# Altium schematic sheet ControlBoard.SchDoc
size A4; SheetNumber: 1; SheetTotal: 1
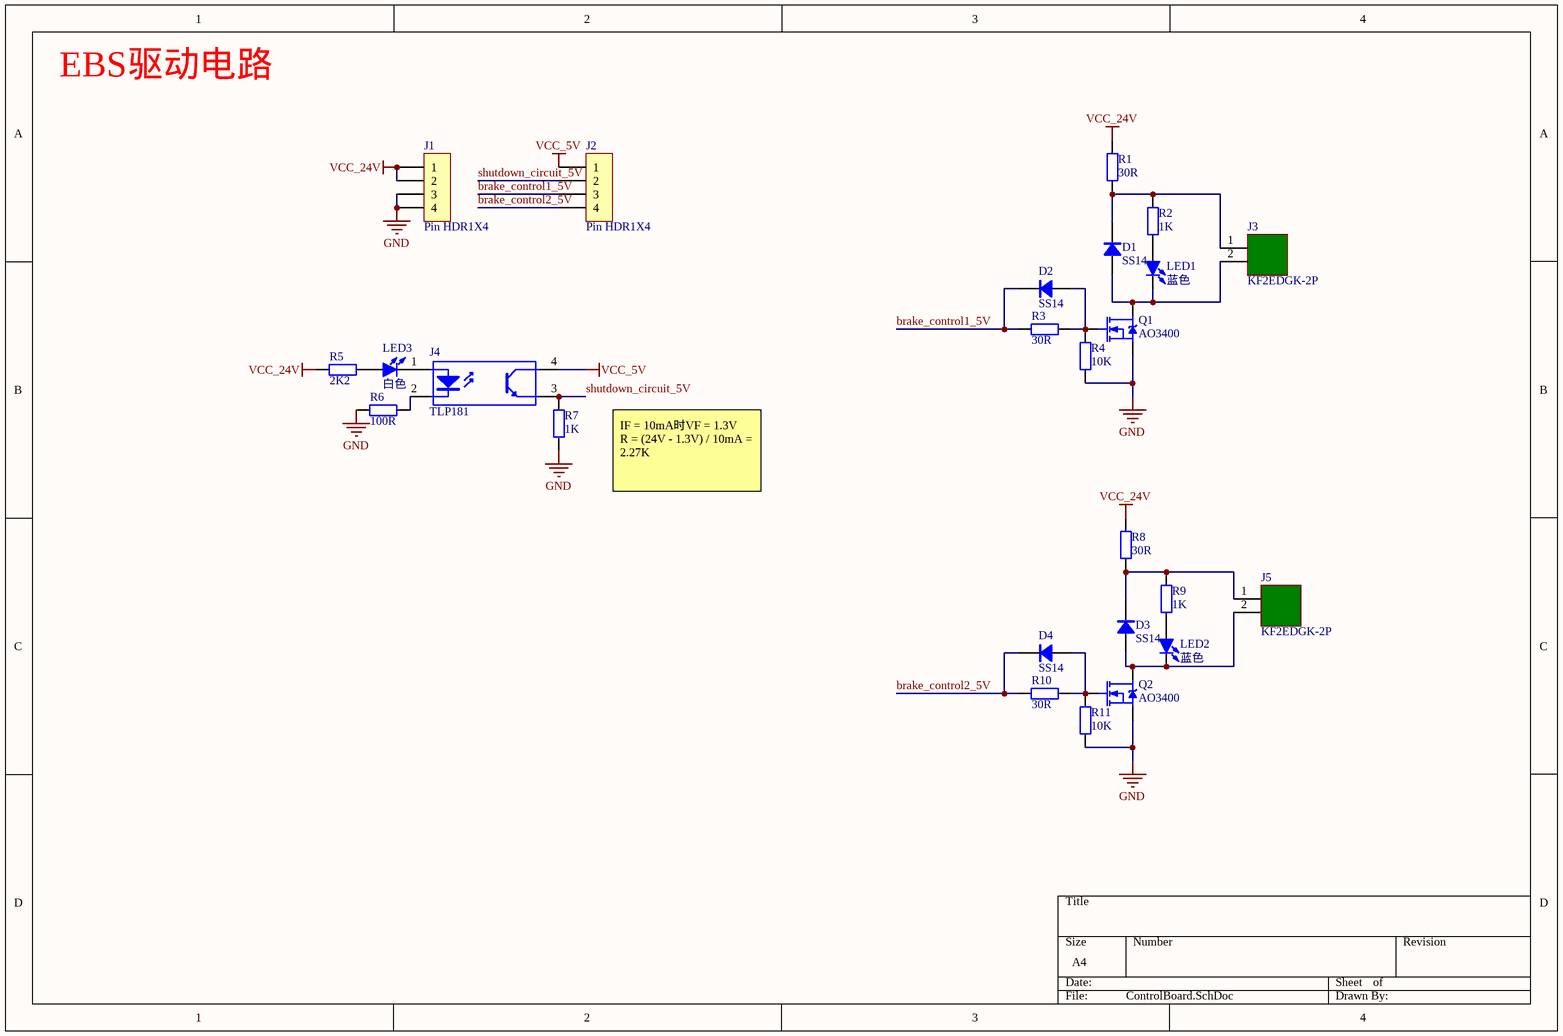
[diagram p0: ControlBoard.SchDoc]

## Parts
D1  SS14  [SMA]
D2  SS14  [SMA]
D3  SS14  [SMA]
D4  SS14  [SMA]
J1  Pin HDR1X4  [Pin HDR1X4/2.54mm-S]
J2  Pin HDR1X4  [Pin HDR1X4/2.54mm-S]
J3  KF2EDGK-2P  [KF2EDGK5.08W-2P]
J4  TLP181  [SOP4]
J5  KF2EDGK-2P  [KF2EDGK5.08W-2P]
LED1  蓝色  [LED 0805B]
LED2  蓝色  [LED 0805B]
LED3  白色  [LED 0805W]
Q1  AO3400  [SOT23]
Q2  AO3400  [SOT23]
R1  30R  [0805R]
R2  1K  [0805R]
R3  30R  [0805R]
R4  10K  [0805R]
R5  2K2  [0805R]
R6  100R  [0805R]
R7  1K  [0805R]
R8  30R  [0805R]
R9  1K  [0805R]
R10  30R  [0805R]
R11  10K  [0805R]

## Nets
GND: J1.3 J1.4 Q1.S Q2.S R4.2 R6.2 R7.2 R11.2
VCC_5V: J2.1 J4.4(C)
VCC_24V: J1.1 J1.2 R1.1 R5.2 R8.1
brake_control1_5V: D2.2(K) J2.3 R3.2
brake_control2_5V: D4.2(K) J2.4 R10.2
shutdown_circuit_5V: J2.2 J4.3(E) R7.1
NetD1_1: D1.1(A) J3.2 LED1.2(K) Q1.D
NetD1_2: D1.2(K) J3.1 R1.2 R2.1
NetD2_1: D2.1(A) Q1.G R3.1 R4.1
NetD3_1: D3.1(A) J5.2 LED2.2(K) Q2.D
NetD3_2: D3.2(K) J5.1 R8.2 R9.1
NetD4_1: D4.1(A) Q2.G R10.1 R11.1
NetJ4_1: J4.1(A) LED3.2(K)
NetJ4_2: J4.2(K) R6.1
NetLED1_1: LED1.1(A) R2.2
NetLED2_1: LED2.1(A) R9.2
NetLED3_1: LED3.1(A) R5.1

## Notes on the sheet
- EBS驱动电路
- IF = 10mA时VF = 1.3V
  R = (24V - 1.3V) / 10mA = 2.27K

## Library data of the parts
D1-D4 = SS14: 肖特基二极管; 版权归属: 源创客; 属性: 40V/1A; BOM名称: 肖特基二极管; 学习资源: www.ooocke.com
J4 = TLP181: 光耦; 版权归属: 源创客; BOM名称: 光耦; 学习资源: www.ooocke.com
LED1-LED3 = LED-SMD: 贴片LED; 版权归属: 源创客; BOM名称: 贴片LED; 学习资源: www.ooocke.com
Q1 Q2 = N-MOS: N沟道场效应管
R1-R11 = RES: 贴片电阻